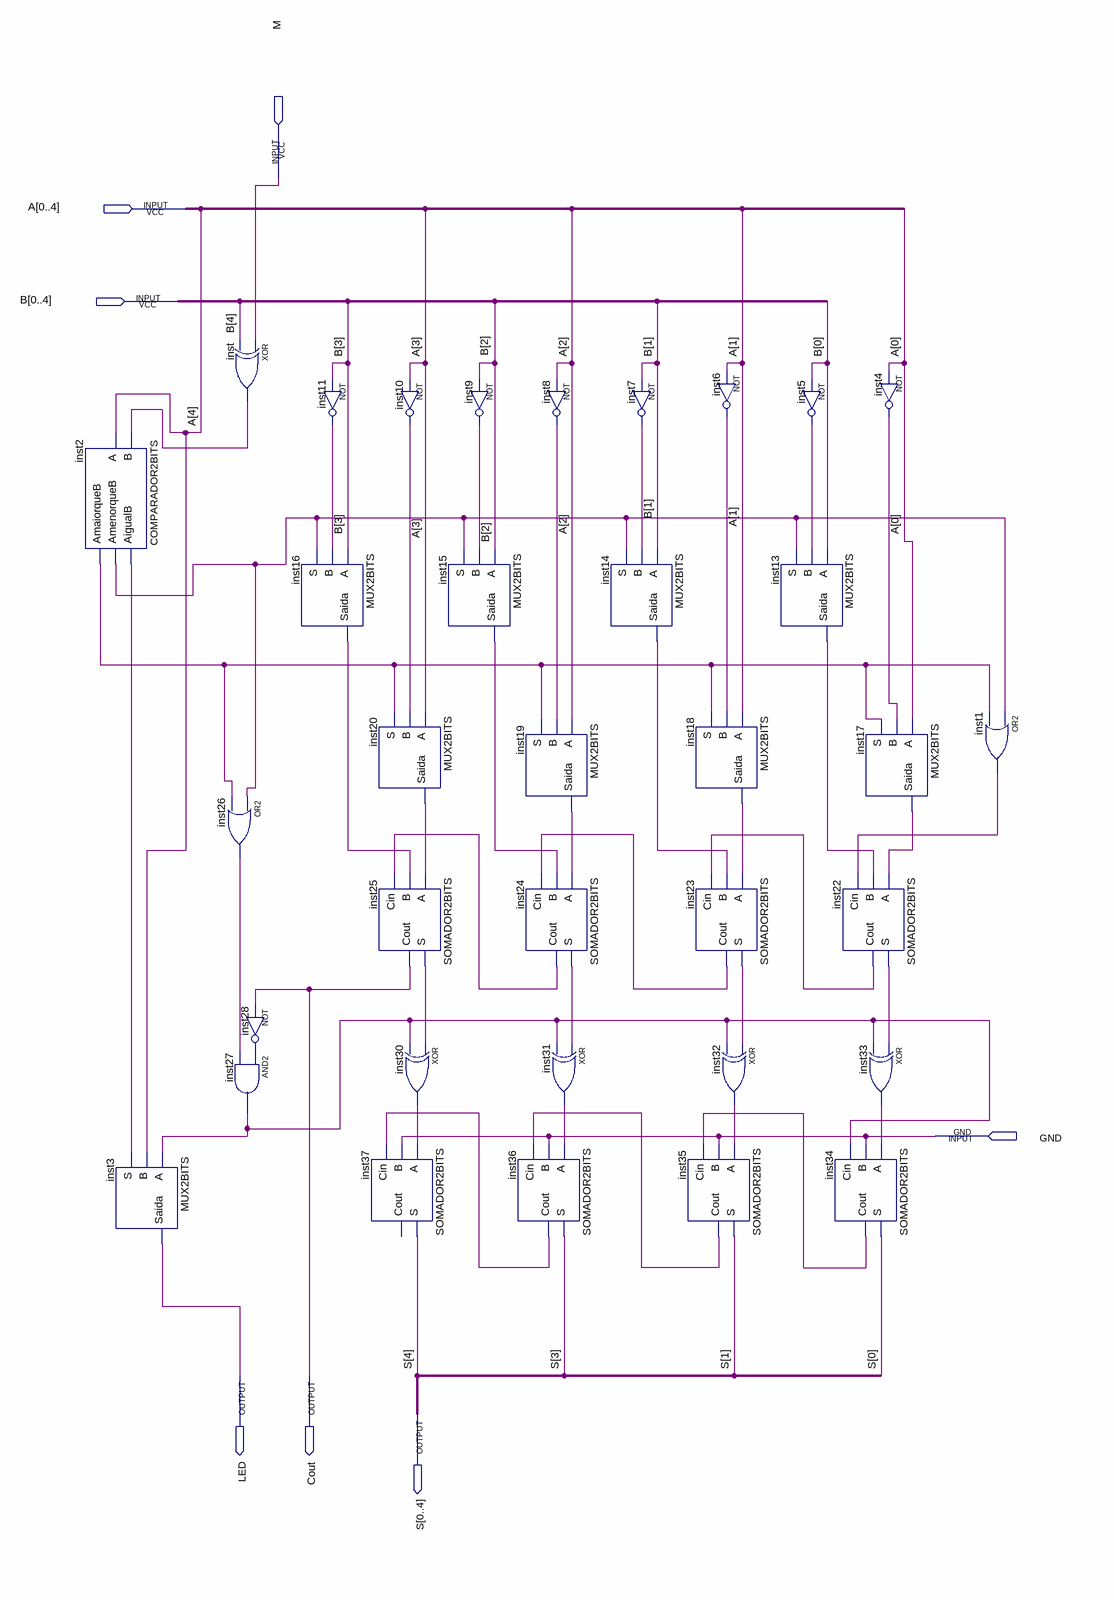
[diagram p0: schematic sheet]
// Quartus schematic SOMADORSUBTRATOR5BITS.bdf as structural Verilog: 35 symbols, 7 pins
module SOMADORSUBTRATOR5BITS (
  input  M,
  input  [0:4] A,
  input  [0:4] B,
  input  GND,
  output LED,
  output Cout,
  output [0:4] S
);

  wire inst1_out, inst2_aigualb, inst2_amaiorqueb, inst2_amenorqueb, inst4_out, inst5_out, inst6_out,
       inst7_out, inst8_out, inst9_out, inst10_out, inst11_out, inst13_saida, inst14_saida, inst15_saida,
       inst16_saida, inst17_saida, inst18_saida, inst19_saida, inst20_saida, inst22_cout, inst22_s,
       inst23_cout, inst23_s, inst24_cout, inst24_s, inst25_s, inst26_out, inst27_out, inst28_out,
       inst30_out, inst31_out, inst32_out, inst33_out, inst34_cout, inst35_cout, inst36_cout, inst_out;

  COMPARADOR2BITS inst2 (
    .B(inst_out), .A(A[4]), .AigualB(inst2_aigualb), .AmenorqueB(inst2_amenorqueb),
    .AmaiorqueB(inst2_amaiorqueb));
  MUX2BITS inst3 (.A(inst27_out), .B(A[4]), .S(inst2_aigualb), .Saida(LED));
  xor inst (inst_out, M, B[4]);
  or inst26 (inst26_out, inst2_amenorqueb, inst2_amaiorqueb);
  not inst28 (inst28_out, Cout);
  and inst27 (inst27_out, inst28_out, inst26_out);
  MUX2BITS inst16 (.A(B[3]), .B(inst11_out), .S(inst2_amenorqueb), .Saida(inst16_saida));
  not inst11 (inst11_out, B[3]);
  MUX2BITS inst20 (.A(A[3]), .B(inst10_out), .S(inst2_amaiorqueb), .Saida(inst20_saida));
  SOMADOR2BITS inst25 (.A(inst20_saida), .B(inst16_saida), .Cin(inst24_cout), .S(inst25_s), .Cout(Cout));
  SOMADOR2BITS inst37 (.A(inst30_out), .B(GND), .Cin(inst36_cout), .S(S[4]));  // open: Cout
  not inst10 (inst10_out, A[3]);
  xor inst30 (inst30_out, inst25_s, inst27_out);
  not inst9 (inst9_out, B[2]);
  MUX2BITS inst15 (.A(B[2]), .B(inst9_out), .S(inst2_amenorqueb), .Saida(inst15_saida));
  not inst8 (inst8_out, A[2]);
  MUX2BITS inst19 (.A(A[2]), .B(inst8_out), .S(inst2_amaiorqueb), .Saida(inst19_saida));
  SOMADOR2BITS inst24 (.A(inst19_saida), .B(inst15_saida), .Cin(inst23_cout), .S(inst24_s), .Cout(inst24_cout));
  xor inst31 (inst31_out, inst24_s, inst27_out);
  SOMADOR2BITS inst36 (.A(inst31_out), .B(GND), .Cin(inst35_cout), .S(S[3]), .Cout(inst36_cout));
  MUX2BITS inst14 (.A(B[1]), .B(inst7_out), .S(inst2_amenorqueb), .Saida(inst14_saida));
  not inst7 (inst7_out, B[1]);
  SOMADOR2BITS inst35 (.A(inst32_out), .B(GND), .Cin(inst34_cout), .S(S[1]), .Cout(inst35_cout));
  not inst6 (inst6_out, A[1]);
  MUX2BITS inst18 (.A(A[1]), .B(inst6_out), .S(inst2_amaiorqueb), .Saida(inst18_saida));
  SOMADOR2BITS inst23 (.A(inst18_saida), .B(inst14_saida), .Cin(inst22_cout), .S(inst23_s), .Cout(inst23_cout));
  xor inst32 (inst32_out, inst23_s, inst27_out);
  not inst5 (inst5_out, B[0]);
  MUX2BITS inst13 (.A(B[0]), .B(inst5_out), .S(inst2_amenorqueb), .Saida(inst13_saida));
  MUX2BITS inst17 (.A(A[0]), .B(inst4_out), .S(inst2_amaiorqueb), .Saida(inst17_saida));
  SOMADOR2BITS inst22 (.A(inst17_saida), .B(inst13_saida), .Cin(inst1_out), .S(inst22_s), .Cout(inst22_cout));
  xor inst33 (inst33_out, inst22_s, inst27_out);
  SOMADOR2BITS inst34 (.A(inst33_out), .B(GND), .Cin(inst27_out), .S(S[0]), .Cout(inst34_cout));
  not inst4 (inst4_out, A[0]);
  or inst1 (inst1_out, inst2_amenorqueb, inst2_amaiorqueb);
endmodule
